# EAGLE schematic rtc (EAGLE 6.4)
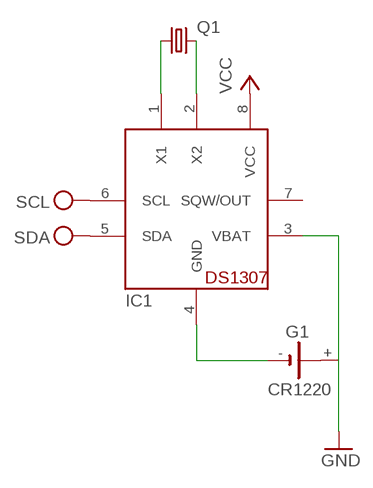
[diagram p0: schematic, sheet 1]

## Parts
G1  CR1220  1V60R  [1V60R]
IC1  DS1307  [DIL08]
Q1  CRYSTALTC38H  [TC38H]

## Nets
GND: G1.+ IC1.3(VBAT)
N$1: IC1.1(X1) Q1.1
N$2: IC1.2(X2) Q1.2
N$3: G1.- IC1.4(GND)
VCC: IC1.5(SDA) IC1.6(SCL) IC1.8(VCC) ; supply symbol labelled SCL, SDA
Unconnected: G1.+@1(+) IC1.7(SQW/OUT)

## Library data of the parts
G1 = battery:1V60R: NC ACCU Varta
IC1 = adafruit:DS1307: DS1307 Real time clock (RTC) with battery backup ability. Talk to it via i2c
Q1 = crystal:CRYSTAL: CRYSTAL; OC_FARNELL: unknown; OC_NEWARK: unknown